# Altium project MachXO3D-QFN72-breakout.PrjPcb
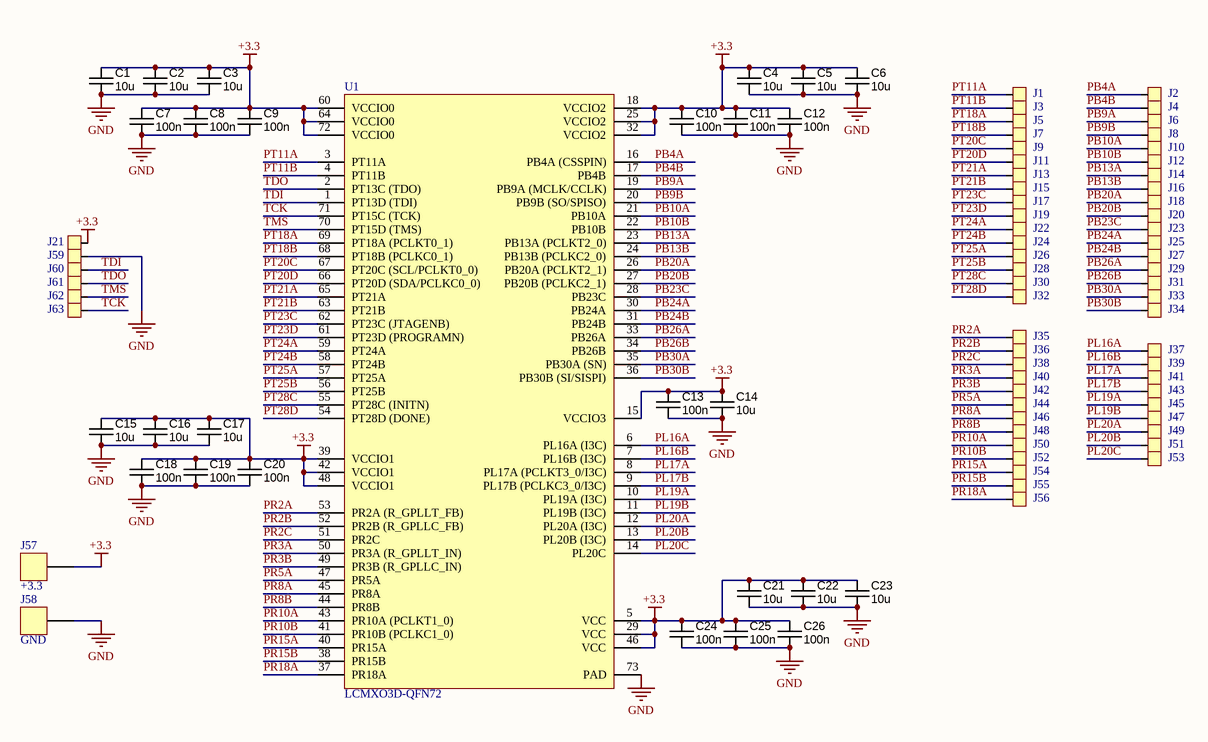
[diagram p0: MachXO3D-QFN72-breakout.SchDoc]
1 sheet, 90 parts. Net scope: global (net labels, ports and power ports of the same name join across sheets).
Board file: MachXO3D-QFN72-breakout.PcbDoc

## Sheet MachXO3D-QFN72-breakout.SchDoc
size A4; SheetNumber: 1; SheetTotal: 1

### Parts
C1  10u  [CAPC1005X55N]
C2  10u  [CAPC1005X55N]
C3  10u  [CAPC1005X55N]
C4  10u  [CAPC1005X55N]
C5  10u  [CAPC1005X55N]
C6  10u  [CAPC1005X55N]
C7  value 100n  [CAPC0603X04N]  (hidden comment: CAPC_100n_0201)
C8  value 100n  [CAPC0603X04N]  (hidden comment: CAPC_100n_0201)
C9  value 100n  [CAPC0603X04N]  (hidden comment: CAPC_100n_0201)
C10  value 100n  [CAPC0603X04N]  (hidden comment: CAPC_100n_0201)
C11  value 100n  [CAPC0603X04N]  (hidden comment: CAPC_100n_0201)
C12  value 100n  [CAPC0603X04N]  (hidden comment: CAPC_100n_0201)
C13  value 100n  [CAPC0603X04N]  (hidden comment: CAPC_100n_0201)
C14  10u  [CAPC1005X55N]
C15  10u  [CAPC1005X55N]
C16  10u  [CAPC1005X55N]
C17  10u  [CAPC1005X55N]
C18  value 100n  [CAPC0603X04N]  (hidden comment: CAPC_100n_0201)
C19  value 100n  [CAPC0603X04N]  (hidden comment: CAPC_100n_0201)
C20  value 100n  [CAPC0603X04N]  (hidden comment: CAPC_100n_0201)
C21  10u  [CAPC1005X55N]
C22  10u  [CAPC1005X55N]
C23  10u  [CAPC1005X55N]
C24  value 100n  [CAPC0603X04N]  (hidden comment: CAPC_100n_0201)
C25  value 100n  [CAPC0603X04N]  (hidden comment: CAPC_100n_0201)
C26  value 100n  [CAPC0603X04N]  (hidden comment: CAPC_100n_0201)
J1  T11A  [PAD-1020]  (value not drawn)
J2  B4A  [PAD-1020]  (value not drawn)
J3  T11B  [PAD-1020]  (value not drawn)
J4  B4B  [PAD-1020]  (value not drawn)
J5  T18A  [PAD-1020]  (value not drawn)
J6  B9A  [PAD-1020]  (value not drawn)
J7  T18B  [PAD-1020]  (value not drawn)
J8  B9B  [PAD-1020]  (value not drawn)
J9  T20C  [PAD-1020]  (value not drawn)
J10  B10A  [PAD-1020]  (value not drawn)
J11  T20D  [PAD-1020]  (value not drawn)
J12  B10B  [PAD-1020]  (value not drawn)
J13  T21A  [PAD-1020]  (value not drawn)
J14  B13A  [PAD-1020]  (value not drawn)
J15  T21B  [PAD-1020]  (value not drawn)
J16  B13B  [PAD-1020]  (value not drawn)
J17  T23C  [PAD-1020]  (value not drawn)
J18  B20A  [PAD-1020]  (value not drawn)
J19  T23D  [PAD-1020]  (value not drawn)
J20  B20B  [PAD-1020]  (value not drawn)
J21  +3.3  [PAD-1020]  (value not drawn)
J22  T24A  [PAD-1020]  (value not drawn)
J23  B23C  [PAD-1020]  (value not drawn)
J24  T24B  [PAD-1020]  (value not drawn)
J25  B24A  [PAD-1020]  (value not drawn)
J26  T25A  [PAD-1020]  (value not drawn)
J27  B24B  [PAD-1020]  (value not drawn)
J28  T25B  [PAD-1020]  (value not drawn)
J29  B26A  [PAD-1020]  (value not drawn)
J30  T28C  [PAD-1020]  (value not drawn)
J31  B26B  [PAD-1020]  (value not drawn)
J32  T28D  [PAD-1020]  (value not drawn)
J33  B30A  [PAD-1020]  (value not drawn)
J34  B30B  [PAD-1020]  (value not drawn)
J35  R2A  [PAD-1020]  (value not drawn)
J36  R2B  [PAD-1020]  (value not drawn)
J37  L16A  [PAD-1020]  (value not drawn)
J38  R2C  [PAD-1020]  (value not drawn)
J39  L16B  [PAD-1020]  (value not drawn)
J40  R3A  [PAD-1020]  (value not drawn)
J41  L17A  [PAD-1020]  (value not drawn)
J42  R3A  [PAD-1020]  (value not drawn)
J43  L17B  [PAD-1020]  (value not drawn)
J44  R5A  [PAD-1020]  (value not drawn)
J45  L19A  [PAD-1020]  (value not drawn)
J46  R8A  [PAD-1020]  (value not drawn)
J47  L19B  [PAD-1020]  (value not drawn)
J48  R8B  [PAD-1020]  (value not drawn)
J49  L20A  [PAD-1020]  (value not drawn)
J50  R10A  [PAD-1020]  (value not drawn)
J51  L20B  [PAD-1020]  (value not drawn)
J52  R10B  [PAD-1020]  (value not drawn)
J53  L20C  [PAD-1020]  (value not drawn)
J54  R15A  [PAD-1020]  (value not drawn)
J55  R15B  [PAD-1020]  (value not drawn)
J56  R18A  [PAD-1020]  (value not drawn)
J57  +3.3  [POWER-PAD-4x3]
J58  GND  [POWER-PAD-4x3]
J59  GND  [PAD-1020]  (value not drawn)
J60  TDI  [PAD-1020]  (value not drawn)
J61  TDO  [PAD-1020]  (value not drawn)
J62  TMS  [PAD-1020]  (value not drawn)
J63  TCK  [PAD-1020]  (value not drawn)
U1  LCMXO3D-QFN72  [MachXO3D-QFN72]

### Nets
+3.3: C1.1 C2.1 C3.1 C4.1 C5.1 C6.1 C7.2 C8.2 C9.2 C10.2 C11.2 C12.2 C13.2 C14.1 C15.1 C16.1 C17.1 C18.2 C19.2 C20.2 C21.1 C22.1 C23.1 C24.2 C25.2 C26.2 J21.1 J57.1 U1.5(VCC) U1.15(VCCIO3) U1.18(VCCIO2) U1.25(VCCIO2) U1.29(VCC) U1.32(VCCIO2) U1.39(VCCIO1) U1.42(VCCIO1) U1.46(VCC) U1.48(VCCIO1) U1.60(VCCIO0) U1.64(VCCIO0) U1.72(VCCIO0)
GND: C1.2 C2.2 C3.2 C4.2 C5.2 C6.2 C7.1 C8.1 C9.1 C10.1 C11.1 C12.1 C13.1 C14.2 C15.2 C16.2 C17.2 C18.1 C19.1 C20.1 C21.2 C22.2 C23.2 C24.1 C25.1 C26.1 J58.1 J59.1 U1.73(PAD)
PB4A: J2.1 U1.16(PB4A_(CSSPIN))
PB4B: J4.1 U1.17(PB4B)
PB9A: J6.1 U1.19(PB9A_(MCLK/CCLK))
PB9B: J8.1 U1.20(PB9B_(SO/SPISO))
PB10A: J10.1 U1.21(PB10A)
PB10B: J12.1 U1.22(PB10B)
PB13A: J14.1 U1.23(PB13A_(PCLKT2_0))
PB13B: J16.1 U1.24(PB13B_(PCLKC2_0))
PB20A: J18.1 U1.26(PB20A_(PCLKT2_1))
PB20B: J20.1 U1.27(PB20B_(PCLKC2_1))
PB23C: J23.1 U1.28(PB23C)
PB24A: J25.1 U1.30(PB24A)
PB24B: J27.1 U1.31(PB24B)
PB26A: J29.1 U1.33(PB26A)
PB26B: J31.1 U1.34(PB26B)
PB30A: J33.1 U1.35(PB30A_(SN))
PB30B: J34.1 U1.36(PB30B_(SI/SISPI))
PL16A: J37.1 U1.6(PL16A_(I3C))
PL16B: J39.1 U1.7(PL16B_(I3C))
PL17A: J41.1 U1.8(PL17A_(PCLKT3_0/I3C))
PL17B: J43.1 U1.9(PL17B_(PCLKC3_0/I3C))
PL19A: J45.1 U1.10(PL19A_(I3C))
PL19B: J47.1 U1.11(PL19B_(I3C))
PL20A: J49.1 U1.12(PL20A_(I3C))
PL20B: J51.1 U1.13(PL20B_(I3C))
PL20C: J53.1 U1.14(PL20C)
PR2A: J35.1 U1.53(PR2A_(R_GPLLT_FB))
PR2B: J36.1 U1.52(PR2B_(R_GPLLC_FB))
PR2C: J38.1 U1.51(PR2C)
PR3A: J40.1 U1.50(PR3A_(R_GPLLT_IN))
PR3B: J42.1 U1.49(PR3B_(R_GPLLC_IN))
PR5A: J44.1 U1.47(PR5A)
PR8A: J46.1 U1.45(PR8A)
PR8B: J48.1 U1.44(PR8B)
PR10A: J50.1 U1.43(PR10A_(PCLKT1_0))
PR10B: J52.1 U1.41(PR10B_(PCLKC1_0))
PR15A: J54.1 U1.40(PR15A)
PR15B: J55.1 U1.38(PR15B)
PR18A: J56.1 U1.37(PR18A)
PT11A: J1.1 U1.3(PT11A)
PT11B: J3.1 U1.4(PT11B)
PT18A: J5.1 U1.69(PT18A_(PCLKT0_1))
PT18B: J7.1 U1.68(PT18B_(PCLKC0_1))
PT20C: J9.1 U1.67(PT20C_(SCL/PCLKT0_0))
PT20D: J11.1 U1.66(PT20D_(SDA/PCLKC0_0))
PT21A: J13.1 U1.65(PT21A)
PT21B: J15.1 U1.63(PT21B)
PT23C: J17.1 U1.62(PT23C_(JTAGENB))
PT23D: J19.1 U1.61(PT23D_(PROGRAMN))
PT24A: J22.1 U1.59(PT24A)
PT24B: J24.1 U1.58(PT24B)
PT25A: J26.1 U1.57(PT25A)
PT25B: J28.1 U1.56(PT25B)
PT28C: J30.1 U1.55(PT28C_(INITN))
PT28D: J32.1 U1.54(PT28D_(DONE))
TCK: J63.1 U1.71(PT15C_(TCK))
TDI: J60.1 U1.1(PT13D_(TDI))
TDO: J61.1 U1.2(PT13C_(TDO))
TMS: J62.1 U1.70(PT15D_(TMS))

### Library data of the parts
C1-C6 C14-C17 C21-C23 = CAPC_1u_0402_X5R_6V3_10%: Capacitor SMD Cer 1uF 10% 16V X5R 0402; Manufacturer 1: AVX Corporation; Manufacturer Part Number 1: 04026D105KAT2A; Ratings: 6.3V; X5R; SCDType: spec; Tolerance: ±10%; Operating Temperature: -55°C ~ 125°C; Package / Case: 0402 (1005 Metric); Size / Dimension: 0.039" L x 0.020" W (1.00mm x 0.50mm); Supplier 1: Digi-Key; Supplier Part Number 1: 478-2583-1-ND; RoHS 1: RoHS Compliant; ComponentLink1URL: http://www.avx.com/docs/Catalogs/cx5r.pdf; ComponentLink1Description: http://www.avx.com/docs/Catalogs/cx5r.pdf; Supplier 2: Digi-Key; Supplier Part Number 2: 311-1438-1-ND; Manufacturer 2: Yageo; Manufacturer Part Number 2: CC0402KRX5R5BB105; RoHS 2: RoHS Compliant; ComponentLink2URL: http://www.yageo.com/documents/recent/UPY-GPHC_X5R_4V-to-50V_12.pdf; ComponentLink2Description: http://www.yageo.com/documents/recent/UPY-GPHC_X5R_4V-to-50V_12.pdf; Supplier 3: Digi-Key; Supplier Part Number 3: 1276-1010-1-ND; Manufacturer 3: Samsung Electro-Mechanics America, Inc; Manufacturer Part Number 3: CL05A105KQ5NNNC; RoHS 3: RoHS Compliant; ComponentLink3URL: http://www.samsungsem.com/servlet/FileDownload?path=productsearch&sname=CL05A105KQ5NNNC.pdf&oname=CL05A105KQ5NNNC.pdf; ComponentLink3Description: http://www.samsungsem.com/servlet/FileDownload?path=productsearch&sname=CL05A105KQ5NNNC.pdf&oname=CL05A105KQ5NNNC.pdf; Supplier 4: Digi-Key; Supplier Part Number 4: 445-4998-1-ND; Manufacturer 4: TDK Corporation; Manufacturer Part Number 4: C1005X5R0J105K050BB; RoHS 4: RoHS Compliant; ComponentLink4URL: http://product.tdk.com/capacitor/mlcc/en/documents/mlcc_commercial_general_en.pdf; ComponentLink4Description: http://product.tdk.com/capacitor/mlcc/en/documents/mlcc_commercial_general_en.pdf; Supplier 5: Digi-Key; Supplier Part Number 5: 490-1320-1-ND; Manufacturer 5: Murata Electronics North America; Manufacturer Part Number 5: GRM155R60J105KE19D; RoHS 5: RoHS Compliant; ComponentLink5URL: http://www.murata.com/products/catalog/pdf/c02e.pdf; ComponentLink5Description: http://www.murata.com/products/catalog/pdf/c02e.pdf; Value: 10u
J1-J56 J59-J63 = SOLDER-PAD
J57 J58 = HEADER-1